# EAGLE design WiiIr (EAGLE 6.5.0)
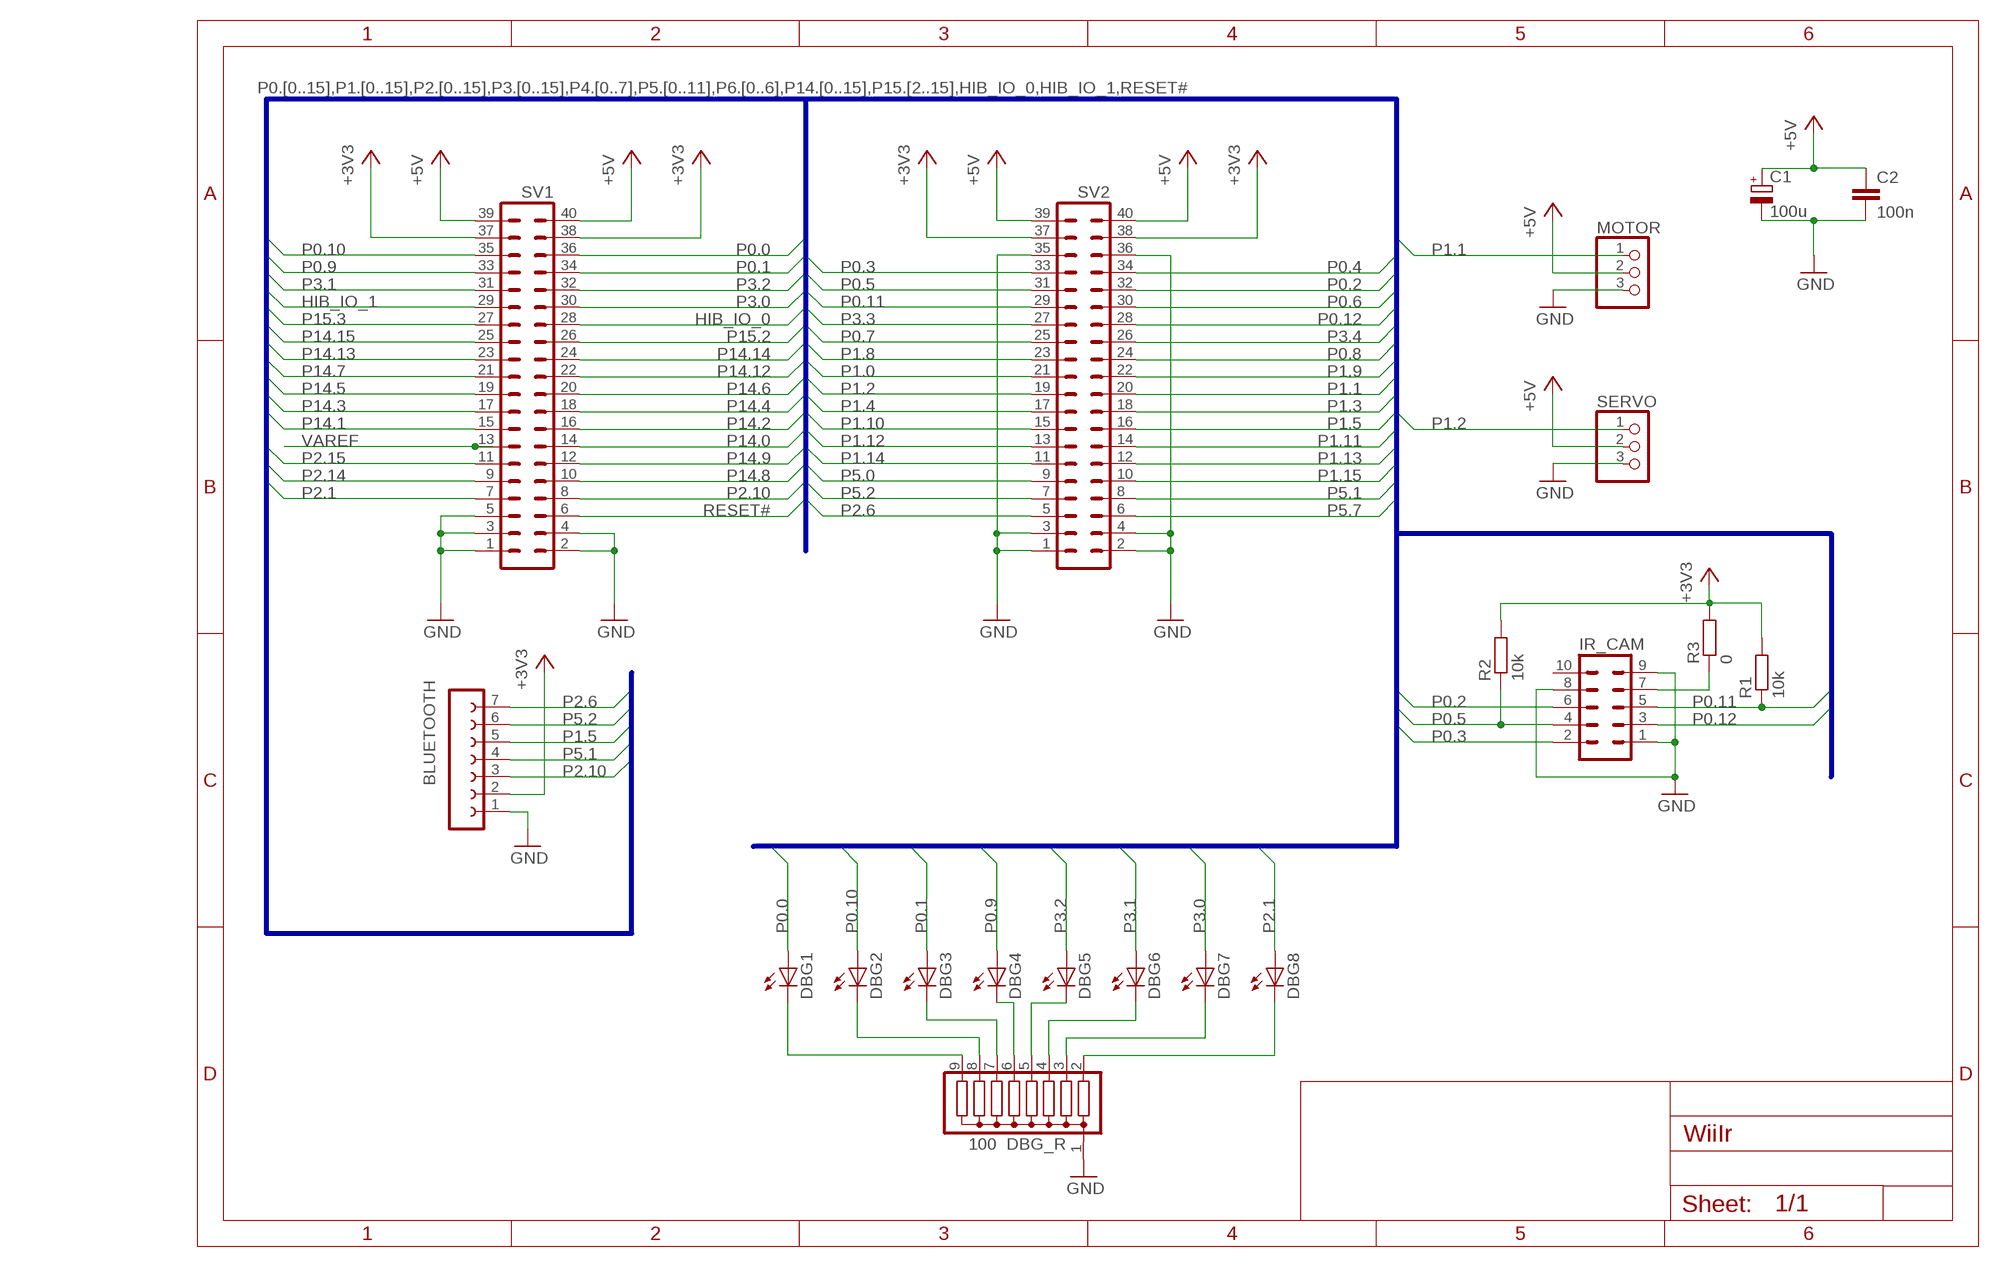
[diagram p0: schematic, sheet 1]

## Parts
BLUETOOTH  FE07-1  [FE07]
C1  100u  CPOL-EUE2.5-7  [E2,5-7]
C2  100n  C-EU050-024X044  [C050-024X044]
DBG1  LEDSQR2X5  [LED2X5]
DBG2  LEDSQR2X5  [LED2X5]
DBG3  LEDSQR2X5  [LED2X5]
DBG4  LEDSQR2X5  [LED2X5]
DBG5  LEDSQR2X5  [LED2X5]
DBG6  LEDSQR2X5  [LED2X5]
DBG7  LEDSQR2X5  [LED2X5]
DBG8  LEDSQR2X5  [LED2X5]
DBG_R  100  G08R  [SIL9]
IR_CAM  ML10  [ML10]
MOTOR  PINHD-1X3/90  [1X03/90]
R1  10k  R-EU_0207/10  [0207/10]
R2  10k  R-EU_0207/10  [0207/10]
R3  0  R-EU_0207/12  [0207/12]
SERVO  PINHD-1X3/90  [1X03/90]
SV1  MA20-2  [MA20-2]
SV2  MA20-2  [MA20-2]

## Nets
+3V3: BLUETOOTH.2 R1.2 R2.2 R3.2 SV1.37 SV1.38 SV2.37 SV2.38
+5V: C1.+ C2.1 MOTOR.2 SERVO.2 SV1.39 SV1.40 SV2.39 SV2.40
GND: BLUETOOTH.1 C1.- C2.2 DBG_R.1 IR_CAM.1 IR_CAM.8 IR_CAM.9 MOTOR.3 SERVO.3 SV1.1 SV1.2 SV1.3 SV1.4 SV1.5 SV2.1 SV2.2 SV2.3 SV2.4 SV2.35 SV2.36
HIB_IO_0: SV1.28
HIB_IO_1: SV1.29
N$1: IR_CAM.7 R3.1
N$2: DBG1.K(C) DBG_R.9
N$3: DBG2.K(C) DBG_R.8
N$4: DBG3.K(C) DBG_R.7
N$5: DBG4.K(C) DBG_R.6
N$6: DBG5.K(C) DBG_R.5
N$7: DBG6.K(C) DBG_R.4
N$8: DBG7.K(C) DBG_R.3
N$9: DBG8.K(C) DBG_R.2
P0.0: DBG1.A SV1.36
P0.1: DBG3.A SV1.34
P0.2: IR_CAM.6 SV2.32
P0.3: IR_CAM.2 SV2.33
P0.4: SV2.34
P0.5: IR_CAM.4 R2.1 SV2.31
P0.6: SV2.30
P0.7: SV2.25
P0.8: SV2.24
P0.9: DBG4.A SV1.33
P0.10: DBG2.A SV1.35
P0.11: IR_CAM.5 R1.1 SV2.29
P0.12: IR_CAM.3 SV2.28
P1.0: SV2.21
P1.1: MOTOR.1 SV2.20
P1.2: SERVO.1 SV2.19
P1.3: SV2.18
P1.4: SV2.17
P1.5: BLUETOOTH.5 SV2.16
P1.8: SV2.23
P1.9: SV2.22
P1.10: SV2.15
P1.11: SV2.14
P1.12: SV2.13
P1.13: SV2.12
P1.14: SV2.11
P1.15: SV2.10
P2.1: DBG8.A SV1.7
P2.6: BLUETOOTH.7 SV2.5
P2.10: BLUETOOTH.3 SV1.8
P2.14: SV1.9
P2.15: SV1.11
P3.0: DBG7.A SV1.30
P3.1: DBG6.A SV1.31
P3.2: DBG5.A SV1.32
P3.3: SV2.27
P3.4: SV2.26
P5.0: SV2.9
P5.1: BLUETOOTH.4 SV2.8
P5.2: BLUETOOTH.6 SV2.7
P5.7: SV2.6
P14.0: SV1.14
P14.1: SV1.15
P14.2: SV1.16
P14.3: SV1.17
P14.4: SV1.18
P14.5: SV1.19
P14.6: SV1.20
P14.7: SV1.21
P14.8: SV1.10
P14.9: SV1.12
P14.12: SV1.22
P14.13: SV1.23
P14.14: SV1.24
P14.15: SV1.25
P15.2: SV1.26
P15.3: SV1.27
RESET#: SV1.6
VAREF: SV1.13
Unconnected: IR_CAM.10

## Buses
P0.[0..15],P1.[0..15],P2.[0..15],P3.[0..15],P4.[0..7],P5.[0..11],P6.[0..6],P14.[0..15],P15.[2..15],HIB_IO_0,HIB_IO_1,RESET#

## Library data of the parts
BLUETOOTH = con-lsta:FE07-1: FEMALE HEADER; OC_FARNELL: unknown; OC_NEWARK: unknown
C1 = resistor:CPOL-EU: POLARIZED CAPACITOR, European symbol
C2 = resistor:C-EU: CAPACITOR, European symbol
DBG1-DBG8 = led:LED: LED OSRAM: - CHIPLED LG R971, LG N971, LY N971, LG Q971, LY Q971, LO R971, LY R971 LH N974, LH R974 LS Q976, LO Q976, LY Q976 LO Q996 - Hyper CHIPLED LW Q18S LB Q993, LB Q99A, LB R99A - SideLED LS A670, LO A670, LY A670, LG A670, LP A670 LB A673, LV A673, LT A673, LW A673 LH A674 LY A675 LS A676, LA A676, LO A676, LY A676, LW A676 LS A679, LY A679, LG A679 - Hyper Micro SIDELED® LS Y876, LA Y876, LO Y876, LY Y876 LT Y87S - SmartLED LW L88C, LW L88S LB L89C, LB L89S, LG L890 LS L89K, LO L89K, LY L89K LS L896, LA L896, LO L896, LY L896 - TOPLED LS T670, LO T670, LY T670, LG T670, LP T670 LSG T670, LSP T670, LSY T670, LOP T670, LYG T670 LG T671, LOG T671, LSG T671 LB T673, LV T673, LT T673, LW T673 LH T674 LS T676, LA T676, LO T676, LY T676, LB T676, LH T676, LSB T676, LW T676 LB T67C, LV T67C, LT T67C, LS T67K, LO T67K, LY T67K, LW E67C LS E67B, LA E67B, LO E67B, LY E67B, LB E67C, LV E67C, LT E67C LW T67C LS T679, LY T679, LG T679 LS T770, LO T770, LY T770, LG T770, LP T770 LB T773, LV T773, LT T773, LW T773 LH T774 LS E675, LA E675, LY E675, LS T675 LS T776, LA T776, LO T776, LY T776, LB T776 LHGB T686 LT T68C, LB T68C - Hyper Mini TOPLED® LB M676 - Mini TOPLED Santana® LG M470 LS M47K, LO M47K, LY M47K Source: http://www.osram.convergy.de LUXEON: - LUMILED® LXK2-PW12-R00, LXK2-PW12-S00, LXK2-PW14-U00, LXK2-PW14-V00 LXK2-PM12-R00, LXK2-PM12-S00, LXK2-PM14-U00 LXK2-PE12-Q00, LXK2-PE12-R00, LXK2-PE12-S00, LXK2-PE14-T00, LXK2-PE14-U00 LXK2-PB12-K00, LXK2-PB12-L00, LXK2-PB12-M00, LXK2-PB14-N00, LXK2-PB14-P00, LXK2-PB14-Q00 LXK2-PR12-L00, LXK2-PR12-M00, LXK2-PR14-Q00, LXK2-PR14-R00 LXK2-PD12-Q00, LXK2-PD12-R00, LXK2-PD12-S00 LXK2-PH12-R00, LXK2-PH12-S00 LXK2-PL12-P00, LXK2-PL12-Q00, LXK2-PL12-R00 Source: www.luxeon.com KINGBRIGHT: KA-3528ASYC Source: www.kingbright.com
DBG_R = resistor-sil:G08R: SIL RESISTOR; OC_FARNELL: unknown; OC_NEWARK: unknown
IR_CAM = con-harting-ml:ML10: HARTING; OC_FARNELL: unknown; OC_NEWARK: unknown
MOTOR SERVO = pinhead:PINHD-1X3: PIN HEADER
R1-R3 = resistor:R-EU_: RESISTOR, European symbol
SV1 SV2 = con-lstb:MA20-2: PIN HEADER; OC_FARNELL: unknown; OC_NEWARK: unknown

## Board
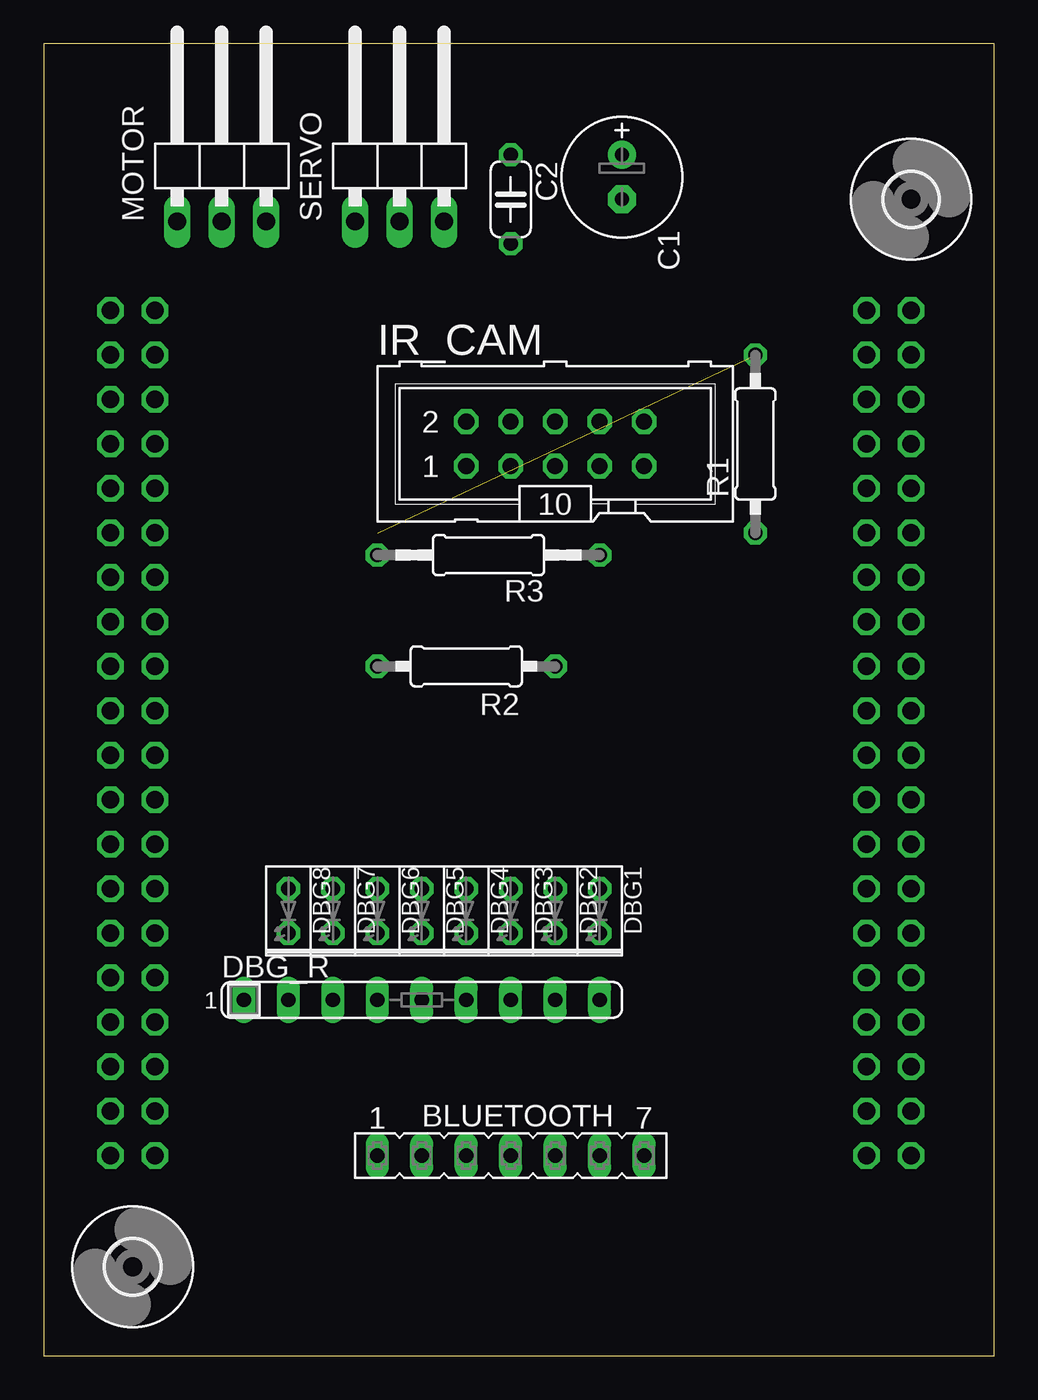
[diagram p1: board, top side]
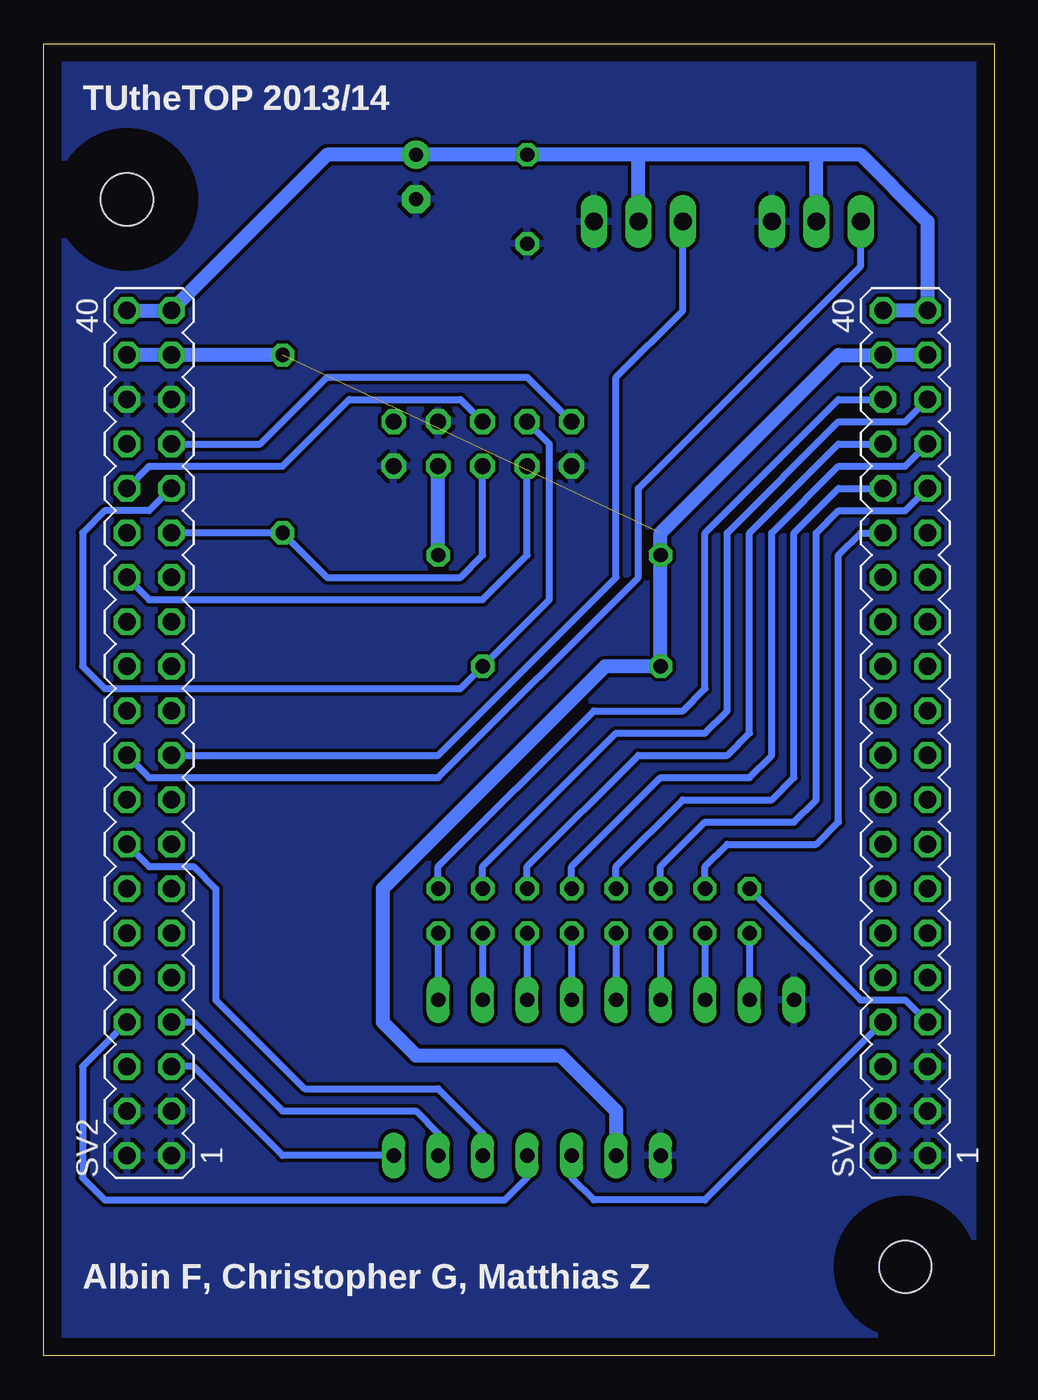
[diagram p2: board, bottom side, seen from below]

Size 54.28 x 74.92 mm. Coordinates in mm from the lower left corner, seen from the top.
Outline: 0,0 54.28,0 54.28,74.92 0,74.92 0,0
Copper layers (1*16): Top 0.035mm / dielectric 1.5mm / Bottom 0.035mm
Design rules "default": minimum track width 10mil, minimum drill 24mil, track to track 8mil, track to pad 8mil, pad to pad 8mil, via to via 8mil, smd to smd 8mil, copper to edge 40mil, drill to drill 8mil, minimum pad ring 10mil, minimum via ring 8mil, stop-mask expansion 4mil, vias tented up to drill 0mil, thermal gap 10mil

### Footprints (pad centres in the part's own frame; a part is rotated, then mirrored left to right if it is on the bottom)
FE07 = drill 0.813 long: 1 -7.62,0; 2 -5.08,0; 3 -2.54,0; 4 0,0; 5 2.54,0; 6 5.08,0; 7 7.62,0
E2,5-7 = drill 0.813 pad 1.6: + -1.27,0 | drill 0.813 pad 1.6 octagon: - 1.27,0
C050-024X044 = drill 0.813 octagon: 1 -2.54,0; 2 2.54,0
LED2X5 = drill 0.813 octagon: A -1.27,0; K 1.27,0
SIL9 = drill 0.813 long: 1 -10.16,0; 2 -7.62,0; 3 -5.08,0; 4 -2.54,0; 5 0,0; 6 2.54,0; 7 5.08,0; 8 7.62,0; 9 10.16,0
ML10 = drill 0.914 octagon: 1 -5.08,-1.27; 2 -5.08,1.27; 3 -2.54,-1.27; 4 -2.54,1.27; 5 0,-1.27; 6 0,1.27; 7 2.54,-1.27; 8 2.54,1.27; 9 5.08,-1.27; 10 5.08,1.27
1X03/90 = drill 1.016 long: 1 -2.54,-3.81; 2 0,-3.81; 3 2.54,-3.81
0207/10 = drill 0.813 octagon: 1 -5.08,0; 2 5.08,0
0207/12 = drill 0.813 octagon: 1 -6.35,0; 2 6.35,0
MA20-2 = drill 1.016 octagon: 1 -24.13,-1.27; 2 -24.13,1.27; 3 -21.59,-1.27; 4 -21.59,1.27; 5 -19.05,-1.27; 6 -19.05,1.27; 7 -16.51,-1.27; 8 -16.51,1.27; 9 -13.97,-1.27; 10 -13.97,1.27; 11 -11.43,-1.27; 12 -11.43,1.27; 13 -8.89,-1.27; 14 -8.89,1.27; 15 -6.35,-1.27; 16 -6.35,1.27; 17 -3.81,-1.27; 18 -3.81,1.27; 19 -1.27,-1.27; 20 -1.27,1.27; 21 1.27,-1.27; 22 1.27,1.27; 23 3.81,-1.27; 24 3.81,1.27; 25 6.35,-1.27; 26 6.35,1.27; 27 8.89,-1.27; 28 8.89,1.27; 29 11.43,-1.27; 30 11.43,1.27; 31 13.97,-1.27; 32 13.97,1.27; 33 16.51,-1.27; 34 16.51,1.27; 35 19.05,-1.27; 36 19.05,1.27; 37 21.59,-1.27; 38 21.59,1.27; 39 24.13,-1.27; 40 24.13,1.27
3,0 = hole 3: 0,0

### Placement (x,y rotation side)
BLUETOOTH  26.67,11.43 0 top
C1  33.02,67.31 270 top
C2  26.67,66.04 270 top
DBG1  31.75,25.4 270 top
DBG2  29.21,25.4 270 top
DBG3  26.67,25.4 270 top
DBG4  24.13,25.4 270 top
DBG5  21.59,25.4 270 top
DBG6  19.05,25.4 270 top
DBG7  16.51,25.4 270 top
DBG8  13.97,25.4 270 top
DBG_R  21.59,20.32 0 top
IR_CAM  29.21,52.07 0 top
MOTOR  10.16,68.58 0 top
R1  40.64,52.07 90 top
R2  24.13,39.37 180 top
R3  25.4,45.72 180 top
SERVO  20.32,68.58 0 top
SV1  5.08,35.56 90 bottom
SV2  48.26,35.56 90 bottom
U$1  [3,0]  5.08,5.08 0 top
U$2  [3,0]  49.53,66.04 0 top

### Tracks (layer width: path | path; a pad name or v marks a point on that pad's centre or on a via)
+3V3  (1 unrouted)
  Bottom 0.813: SV2.38 SV2.37 R1.2 | SV1.37 SV1.38 8.89,57.15 19.05,46.99 R3.2 R2.2 22.23,39.37 34.92,26.67 34.92,19.05 33.02,17.14 24.77,17.14 21.59,13.97 BLUETOOTH.2
+5V
  Bottom 0.813: SV2.40 SV2.39 38.1,68.58 C1.+ C2.1 20.32,68.58 | SV1.40 SV1.39 3.81,64.77 7.62,68.58 10.16,68.58 | 10.16,68.58 20.32,68.58 | MOTOR.2 10.16,68.58 | SERVO.2 20.32,68.58
GND
  pour Bottom: -2.54,77.47 55.88,77.47 55.88,-3.81 -2.54,-3.81
N$1
  Bottom 0.813: R3.1 IR_CAM.7
N$2
  Bottom 0.406: DBG1.K DBG_R.9
N$3
  Bottom 0.406: DBG2.K DBG_R.8
N$4
  Bottom 0.406: DBG3.K DBG_R.7
N$5
  Bottom 0.406: DBG4.K DBG_R.6
N$6
  Bottom 0.406: DBG5.K DBG_R.5
N$7
  Bottom 0.406: DBG6.K DBG_R.4
N$8
  Bottom 0.406: DBG7.K DBG_R.3
N$9
  Bottom 0.406: DBG8.K DBG_R.2
P0.0
  Bottom 0.406: DBG1.A 31.75,27.94 22.86,36.83 17.78,36.83 16.51,38.1 16.51,46.99 8.89,54.61 SV1.36
P0.1
  Bottom 0.406: DBG3.A 26.67,27.94 20.32,34.29 15.24,34.29 13.97,35.56 13.97,46.99 8.89,52.07 SV1.34
P0.2
  Bottom 0.406: SV2.32 48.26,50.8 40.64,50.8 36.83,54.61 30.48,54.61 IR_CAM.6
P0.3
  Bottom 0.406: SV2.33 41.91,52.07 38.1,55.88 26.67,55.88 IR_CAM.2
P0.5
  Bottom 0.406: SV2.31 48.26,48.26 50.8,48.26 52.07,46.99 52.07,39.37 50.8,38.1 30.48,38.1 R2.1 25.4,43.18 25.4,52.07 IR_CAM.4
P0.9
  Bottom 0.406: DBG4.A 24.13,27.94 19.05,33.02 13.97,33.02 12.7,34.29 12.7,46.99 8.89,50.8 5.08,50.8 SV1.33
P0.10
  Bottom 0.406: DBG2.A 29.21,27.94 21.59,35.56 16.51,35.56 15.24,36.83 15.24,46.99 8.89,53.34 5.08,53.34 SV1.35
P0.11
  Bottom 0.406: SV2.29 R1.1 38.1,44.45 30.48,44.45 29.21,45.72 IR_CAM.5
P0.12
  Bottom 0.406: SV2.28 48.26,43.18 29.21,43.18 26.67,45.72 IR_CAM.3
P1.1
  Bottom 0.406: SV2.20 48.26,33.02 31.75,33.02 20.32,44.45 20.32,49.53 7.62,62.23 MOTOR.1
P1.2
  Bottom 0.406: SV2.19 31.75,34.29 21.59,44.45 21.59,55.88 17.78,59.69 SERVO.1
P1.5
  Bottom 0.406: SV2.16 48.26,27.94 45.72,27.94 44.45,26.67 44.45,20.32 39.37,15.24 31.75,15.24 29.21,12.7 BLUETOOTH.5
P2.1
  Bottom 0.406: DBG8.A 7.62,20.32 5.08,20.32 SV1.7
P2.6
  Bottom 0.406: BLUETOOTH.7 40.64,11.43 45.72,16.51 SV2.5
P2.10
  Bottom 0.406: SV1.8 16.51,8.89 22.86,8.89 24.13,10.16 BLUETOOTH.3
P3.0
  Bottom 0.406: DBG7.A 16.51,27.94 15.24,29.21 10.16,29.21 8.89,30.48 8.89,45.72 7.62,46.99 SV1.30
P3.1
  Bottom 0.406: DBG6.A 19.05,27.94 16.51,30.48 11.43,30.48 10.16,31.75 10.16,46.99 8.89,48.26 5.08,48.26 SV1.31
P3.2
  Bottom 0.406: DBG5.A 21.59,27.94 17.78,31.75 12.7,31.75 11.43,33.02 11.43,46.99 8.89,49.53 SV1.32
P5.1
  Bottom 0.406: SV2.8 52.07,16.51 52.07,10.16 50.8,8.89 27.94,8.89 26.67,10.16 BLUETOOTH.4
P5.2
  Bottom 0.406: SV2.7 45.72,19.05 40.64,13.97 33.02,13.97 31.75,12.7 BLUETOOTH.6

### Text on the board
bNames: TUtheTOP 2013/14 | Albin F, Christopher G, Matthias Z